# EAGLE design MSP_Power_Board_revA (1) (EAGLE 9.5.1)
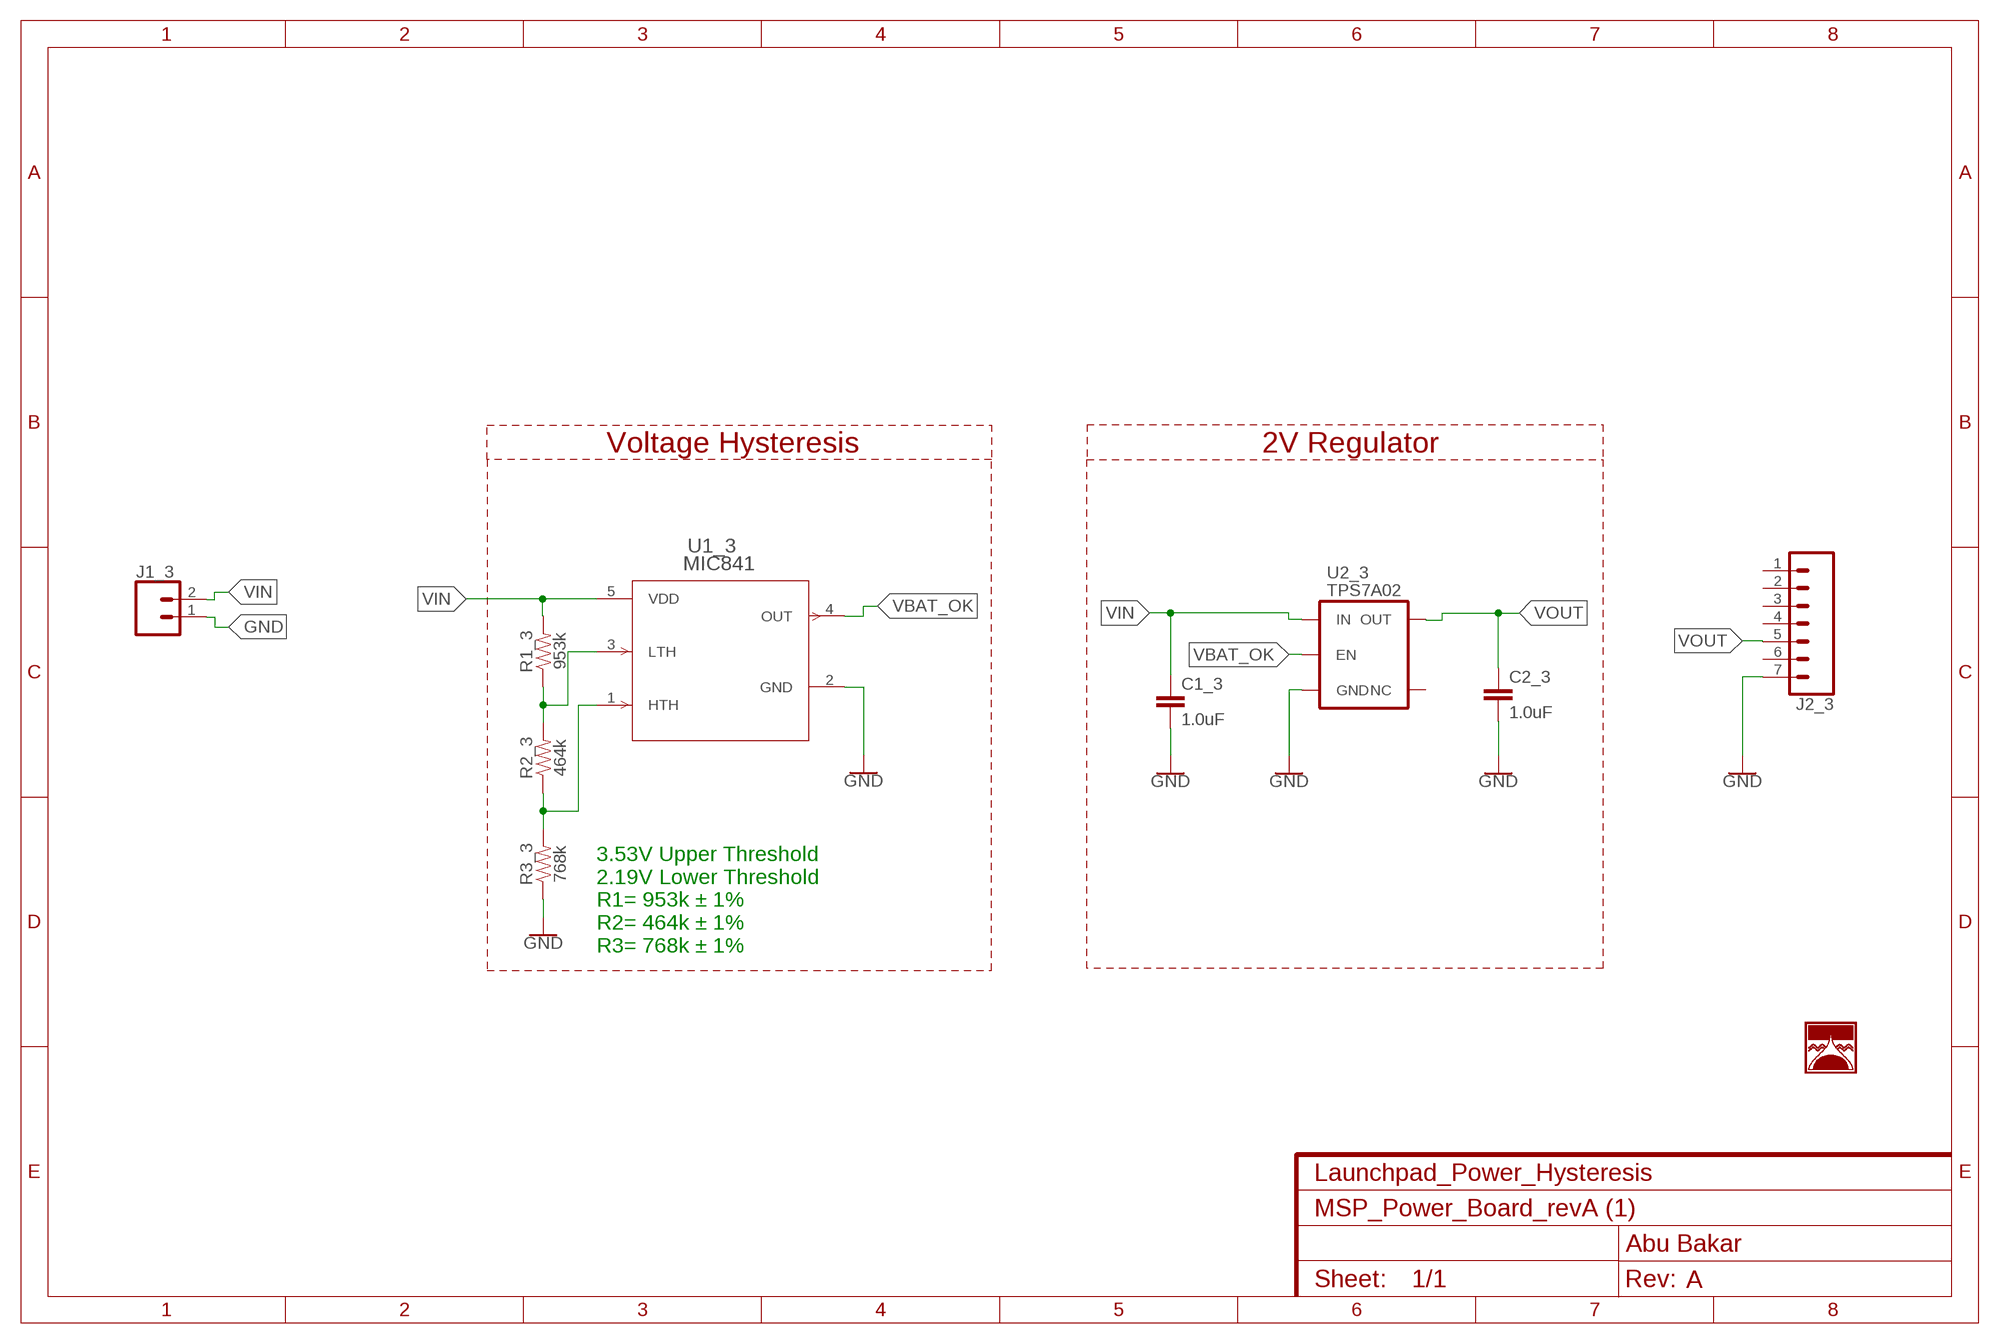
[diagram p0: schematic, sheet 1]
FRAME1 (FRAME-A4L): CNAME: Launchpad_Power_Hysteresis; CREVISION: A; DESIGNER: Abu Bakar

## Parts
C1_3  1.0uF  1.0UF-0603-16V-10%  [0603]
C2_3  1.0uF  1.0UF-0603-16V-10%  [0603]
J1_3  CONN_02  [1X02]
J2_3  CONN_07  [1X07]
R1_3  953k  RESISTOR0603  [0603]
R2_3  464k  RESISTOR0603  [0603]
R3_3  768k  RESISTOR0603  [0603]
U1_3  MIC841  MIC841HYC5-TR  [SC-70_C5_MCH]
U2_3  TPS7A02  [SOT23-5]
U$1_3  KAMOAMOA_LOGO_4X4MM  [LOGO_4X4MM]

## Nets
GND: C1_3.2 C2_3.2 J1_3.1 J2_3.7 R3_3.1 U1_3.2(GND) U2_3.2(GND)
N$7: R1_3.1 R2_3.2 U1_3.3(LTH)
N$8: R2_3.1 R3_3.2 U1_3.1(HTH)
VBAT_OK: U1_3.4(OUT) U2_3.3(EN)
VIN: C1_3.1 J1_3.2 R1_3.2 U1_3.5(VDD) U2_3.1(IN)
VOUT: C2_3.1 J2_3.5 U2_3.5(OUT)
Unconnected: J2_3.1 J2_3.2 J2_3.3 J2_3.4 J2_3.6 U2_3.4(NC)

## Notes on the sheet
- Voltage Hysteresis | 2V Regulator
- 3.53V Upper Threshold 
  2.19V Lower Threshold
  R1= 953k ± 1%
  R2= 464k ± 1%
  R3= 768k ± 1%

## Library data of the parts
C1_3 C2_3 = SparkFun-Capacitors:1.0UF: 1µF ceramic capacitors A capacitor is a passive two-terminal electrical component used to store electrical energy temporarily in an electric field.; PROD_ID: CAP-00868
J1_3 = SparkFun-Connectors:CONN_02: Multi connection point. Often used as Generic Header-pin footprint for 0.1 inch spaced/style header connections On any of the 0.1 inch spaced packages, you can populate with these: Break Away Headers - Straight <https://www.sparkfun.com/products/116> (PRT-00116) Break Away Male Headers - Right Angle <https://www.sparkfun.com/products/553> (PRT-00553) Female Headers <https://www.sparkfun.com/products/115> (PRT-00115) Break Away Headers - Machine Pin <https://www.sparkfun.com/products/117> (PRT-00117) Break Away Female Headers - Swiss Machine Pin <https://www.sparkfun.com/products/743> (PRT-00743) For SCREWTERMINALS and SPRING TERMINALS visit here: Screw Terimnals on SparkFun.com <https://www.sparkfun.com/search/results?term=Screw+Terminals> (5mm/3.5mm/2.54mm spacing) This device is also useful as a general connection point to wire up your design to another part of your project. Our various solder wires solder well into these plated through hole pads. Hook-Up Wire - Assortment (Stranded, 22 AWG) <https://www.sparkfun.com/products/11375> (PRT-11375) Hook-Up Wire - Assortment (Solid Core, 22 AWG) <https://www.sparkfun.com/products/11367> (PRT-11367) View the entire wire category on our website here <https://www.sparkfun.com/categories/141> Special notes: Molex polarized connector foot print use with: PRT-08233 with associated crimp pins and housings. 2.54_SCREWTERM for use with PRT-10571. 3.5mm Screw Terminal footprints for PRT-08084 5mm Screw Terminal footprints for use with PRT-08432
J2_3 = SparkFun-Connectors:CONN_07: Multi connection point. Often used as Generic Header-pin footprint for 0.1 inch spaced/style header connections On any of the 0.1 inch spaced packages, you can populate with these: Break Away Headers - Straight <https://www.sparkfun.com/products/116> (PRT-00116) Break Away Male Headers - Right Angle <https://www.sparkfun.com/products/553> (PRT-00553) Female Headers <https://www.sparkfun.com/products/115> (PRT-00115) Break Away Headers - Machine Pin <https://www.sparkfun.com/products/117> (PRT-00117) Break Away Female Headers - Swiss Machine Pin <https://www.sparkfun.com/products/743> (PRT-00743) For SCREWTERMINALS and SPRING TERMINALS visit here: Screw Terimnals on SparkFun.com <https://www.sparkfun.com/search/results?term=Screw+Terminals> (5mm/3.5mm/2.54mm spacing) This device is also useful as a general connection point to wire up your design to another part of your project. Our various solder wires solder well into these plated through hole pads. Hook-Up Wire - Assortment (Stranded, 22 AWG) <https://www.sparkfun.com/products/11375> (PRT-11375) Hook-Up Wire - Assortment (Solid Core, 22 AWG) <https://www.sparkfun.com/products/11367> (PRT-11367) View the entire wire category on our website here <https://www.sparkfun.com/categories/141> Special notes: Molex polarized connector foot print use with SKU : PRT-08231 with associated crimp pins and housings. 1MM SMD Version SKU: PRT-10208 NOTES ON THE VARIANTS LOCK and LOCK_LONGPADS... This footprint was designed to help hold the alignment of a through-hole component (i.e. 6-pin header) while soldering it into place. You may notice that each hole has been shifted either up or down by 0.005 of an inch from it's more standard position (which is a perfectly straight line). This slight alteration caused the pins (the squares in the middle) to touch the edges of the holes. Because they are alternating, it causes a "brace" to hold the component in place. 0.005 has proven to be the perfect amount of "off-center" position when using our standard breakaway headers. Although looks a little odd when you look at the bare footprint, once you have a header in there, the alteration is very hard to notice. Also,if you push a header all the way into place, it is covered up entirely on the bottom side.
R1_3 R2_3 R3_3 = SparkFun-Resistors:RESISTOR: Generic Resistor Package
U1_3 = super-sensor:MIC841HYC5-TR; BUILT_BY: EMA_Jessica; COPYRIGHT: Copyright (C) 2018 Accelerated Designs. All rights reserved; MANUFACTURER_PART_NUMBER: MIC841NYC5-TR; SOURCELIBRARY: Microchip_2019-08-23_3; VENDOR: Microchip
U2_3 = TexasInstruments-Regulators:TPS7A02: TPS7A0220PDBVR
U$1_3 = logos:KAMOAMOA_LOGO_4X4MM

## Board
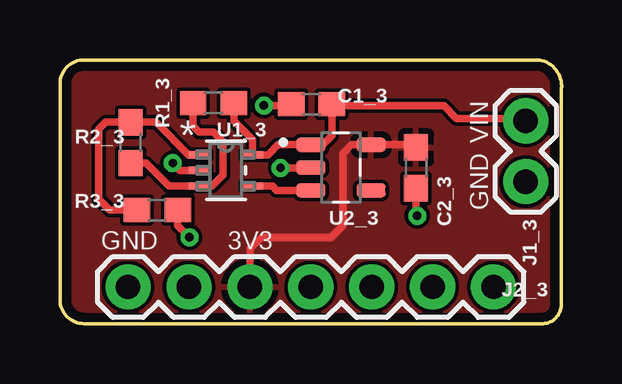
[diagram p1: board, top side]
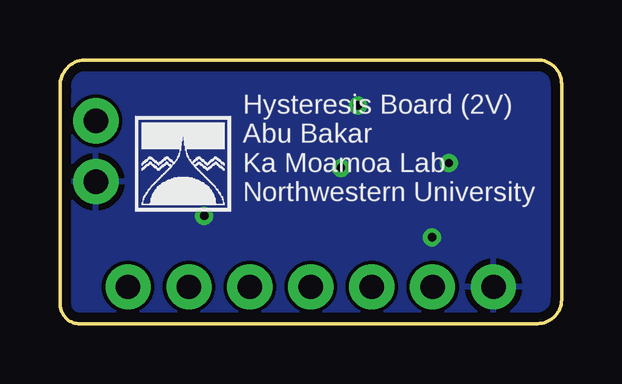
[diagram p2: board, bottom side, seen from below]

Size 20.92 x 11.01 mm. Coordinates in mm from the lower left corner, seen from the top.
Outline: 1,0.01 20,0.01 arc90 20.9,0.71 20.9,9.71 arc90 20,11.01 1,11.01 arc90 0,10.01 0,1.01 arc90 1,0.01
Copper layers (1*16): Top 0.035559375mm / dielectric 1.6mm / Bottom 0.035559375mm
Design rules "oshpark-2layer": minimum track width 6mil, minimum drill 10mil, track to track 6mil, track to pad 6mil, pad to pad 6mil, via to via 6mil, smd to smd 6mil, copper to edge 15mil, drill to drill 6mil, minimum pad ring 5mil, minimum via ring 5mil, stop-mask expansion 2.5mil, vias tented up to drill 0mil, thermal gap 10mil

### Footprints (pad centres in the part's own frame; a part is rotated, then mirrored left to right if it is on the bottom)
0603 = smd 1.1 x 1: 1 -0.85,0; 2 0.85,0
1X02 = drill 1.016 pad 1.88: 1 0,0; 2 2.54,0
1X07 = drill 1.016 pad 1.88: 1 0,0; 2 2.54,0; 3 5.08,0; 4 7.62,0; 5 10.16,0; 6 12.7,0; 7 15.24,0
SC-70_C5_MCH = smd 0.876 x 0.305: 1 -1.111,0.65; 2 -1.111,0; 3 -1.111,-0.65; 4 1.111,-0.65; 5 1.111,0.65
SOT23-5 = smd 1.21 x 0.59: 1 -1.255,0.95; 2 -1.255,0; 3 -1.255,-0.95; 4 1.255,-0.95; 5 1.255,0.95

### Placement (x,y rotation side)
C1_3  10.49,9.16 180 top
C2_3  14.85,6.51 270 top
J1_3  19.42,5.93 90 top
J2_3  18.08,1.54 180 top
R1_3  6.4,9.21 0 top
R2_3  2.94,7.56 270 top
R3_3  4.06,4.75 180 top
U1_3  6.92,6.4 0 top
U2_3  11.72,6.52 0 top
U$1_3  13.8,4.71 0 top

### Tracks (layer width: path | path; a pad name or v marks a point on that pad's centre or on a via)
GND  (via drill 0.35 pad 0.75)
  Top 0.305: v4.7,6.71 5.01,6.4 U1_3.2 | v8.5,9.11 9.59,9.11 C1_3.2 | v14.9,4.51 14.85,4.56 C2_3.2 | v5.4,3.61 4.91,4.1 R3_3.1 | U2_3.2 v9.2,6.51
  pour Bottom: -2,13.01 23,13.01 23,-1.99 -2,-1.99
N$7
  Top 0.305: R1_3.1 5.55,8.26 5.8,8.01 6.4,8.01 6.8,7.61 6.8,6.21 6.34,5.75 U1_3.3 4.56,5.75 3.6,6.71 R2_3.2
N$8
  Top 0.305: R3_3.2 2.07,4.75 1.61,5.21 1.61,8.12 1.9,8.41 R2_3.1 4,8.41 5.36,7.05 U1_3.1
VBAT_OK
  Top 0.305: U1_3.4 8.86,5.75 9.04,5.57 U2_3.3
VIN
  Top 0.305: J1_3.2 19.32,8.57 16.54,8.57 16,9.11 11.39,9.11 C1_3.1 11.34,7.85 10.96,7.47 U2_3.1 9.1,7.47 8.68,7.05 U1_3.5 8.03,7.67 7.25,8.46 R1_3.2
VOUT
  Top 0.305: C2_3.1 14.74,7.47 U2_3.5 12.16,7.47 11.8,7.11 11.8,4.11 11.3,3.61 8.4,3.61 7.92,3.13 J2_3.5
  pour Top: -1,12.01 -1,-0.99 22,-0.99 22,12.01

### Text on the board
tNames: VIN | GND | GND | 3V3
bNames: Hysteresis Board (2V) / Abu Bakar / Ka Moamoa Lab / Northwestern University